# EAGLE design double layer relaycircuit (EAGLE 7.5.0)
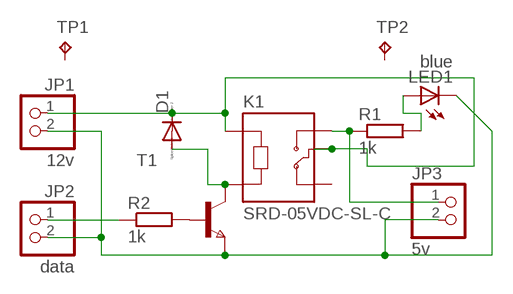
[diagram p0: schematic, sheet 1]

## Parts
D1  DIODE-SOD323-W  [SOD323-W]
JP1  12v  PINHD-1X2  [1X02]
JP2  data  PINHD-1X2  [1X02]
JP3  5v  PINHD-1X2  [1X02]
K1  SRD-05VDC-SL-C  [RELAY_SRD-05VDC-SL-C]
LED1  blue  LED5MM  [LED5MM]
R1  1k  R-EU_M0805  [M0805]
R2  1k  R-EU_M0805  [M0805]
T1  NPNSOT23  [SOT-23]
TP1  TPB1,27  [B1,27]
TP2  TPB1,27  [B1,27]

## Nets
N$1: JP3.1 K1.NO R1.1
N$2: R2.2 T1.3(B)
N$3: D1.A K1.A2 T1.1(C)
N$4: LED1.A R1.2
N$6: JP1.2 JP2.2 JP3.2 LED1.K(C) T1.2(E)
N$7: JP2.1 R2.1
N$8: D1.C JP1.1 K1.A1 K1.COM
Unconnected: K1.NC TP1.TP TP2.TP

## Library data of the parts
D1 = diode:DIODE-: DIODE
JP1-JP3 = pinhead:PINHD-1X2: PIN HEADER
K1 = SRD-05VDC-SL-C (1):SRD-05VDC-SL-C: 5V Trigger Relay Module For Arduino And Raspberry Pi 5V Trigger Relay Module For Arduino And Raspberry Pi Check availability <https://pricing.snapeda.com/parts/SRD-05VDC-SL-C/Songle%20Relay/view-part?ref=eda>; AVAILABILITY: Not in stock; DESCRIPTION: 5V Trigger Relay Module For Arduino And Raspberry Pi 5V Trigger Relay Module For Arduino And Raspberry Pi; MF: Songle Relay; MP: SRD-05VDC-SL-C; PACKAGE: None; PRICE: None
LED1 = led:LED: LED OSRAM: - CHIPLED LG R971, LG N971, LY N971, LG Q971, LY Q971, LO R971, LY R971 LH N974, LH R974 LS Q976, LO Q976, LY Q976 LO Q996 - Hyper CHIPLED LW Q18S LB Q993, LB Q99A, LB R99A - SideLED LS A670, LO A670, LY A670, LG A670, LP A670 LB A673, LV A673, LT A673, LW A673 LH A674 LY A675 LS A676, LA A676, LO A676, LY A676, LW A676 LS A679, LY A679, LG A679 - Hyper Micro SIDELED® LS Y876, LA Y876, LO Y876, LY Y876 LT Y87S - SmartLED LW L88C, LW L88S LB L89C, LB L89S, LG L890 LS L89K, LO L89K, LY L89K LS L896, LA L896, LO L896, LY L896 - TOPLED LS T670, LO T670, LY T670, LG T670, LP T670 LSG T670, LSP T670, LSY T670, LOP T670, LYG T670 LG T671, LOG T671, LSG T671 LB T673, LV T673, LT T673, LW T673 LH T674 LS T676, LA T676, LO T676, LY T676, LB T676, LH T676, LSB T676, LW T676 LB T67C, LV T67C, LT T67C, LS T67K, LO T67K, LY T67K, LW E67C LS E67B, LA E67B, LO E67B, LY E67B, LB E67C, LV E67C, LT E67C LW T67C LS T679, LY T679, LG T679 LS T770, LO T770, LY T770, LG T770, LP T770 LB T773, LV T773, LT T773, LW T773 LH T774 LS E675, LA E675, LY E675, LS T675 LS T776, LA T776, LO T776, LY T776, LB T776 LHGB T686 LT T68C, LB T68C - Hyper Mini TOPLED® LB M676 - Mini TOPLED Santana® LG M470 LS M47K, LO M47K, LY M47K Source: http://www.osram.convergy.de LUXEON: - LUMILED® LXK2-PW12-R00, LXK2-PW12-S00, LXK2-PW14-U00, LXK2-PW14-V00 LXK2-PM12-R00, LXK2-PM12-S00, LXK2-PM14-U00 LXK2-PE12-Q00, LXK2-PE12-R00, LXK2-PE12-S00, LXK2-PE14-T00, LXK2-PE14-U00 LXK2-PB12-K00, LXK2-PB12-L00, LXK2-PB12-M00, LXK2-PB14-N00, LXK2-PB14-P00, LXK2-PB14-Q00 LXK2-PR12-L00, LXK2-PR12-M00, LXK2-PR14-Q00, LXK2-PR14-R00 LXK2-PD12-Q00, LXK2-PD12-R00, LXK2-PD12-S00 LXK2-PH12-R00, LXK2-PH12-S00 LXK2-PL12-P00, LXK2-PL12-Q00, LXK2-PL12-R00 Source: www.luxeon.com KINGBRIGHT: KA-3528ASYC Source: www.kingbright.com
R1 R2 = rcl:R-EU_: RESISTOR, European symbol
T1 = zetex:NPNSOT23: NPN TRANSISTOR; MPN: DSS20201L-7; OC_FARNELL: 1710688; OC_NEWARK: 25R4555
TP1 TP2 = testpad:TP: Test pad

## Board
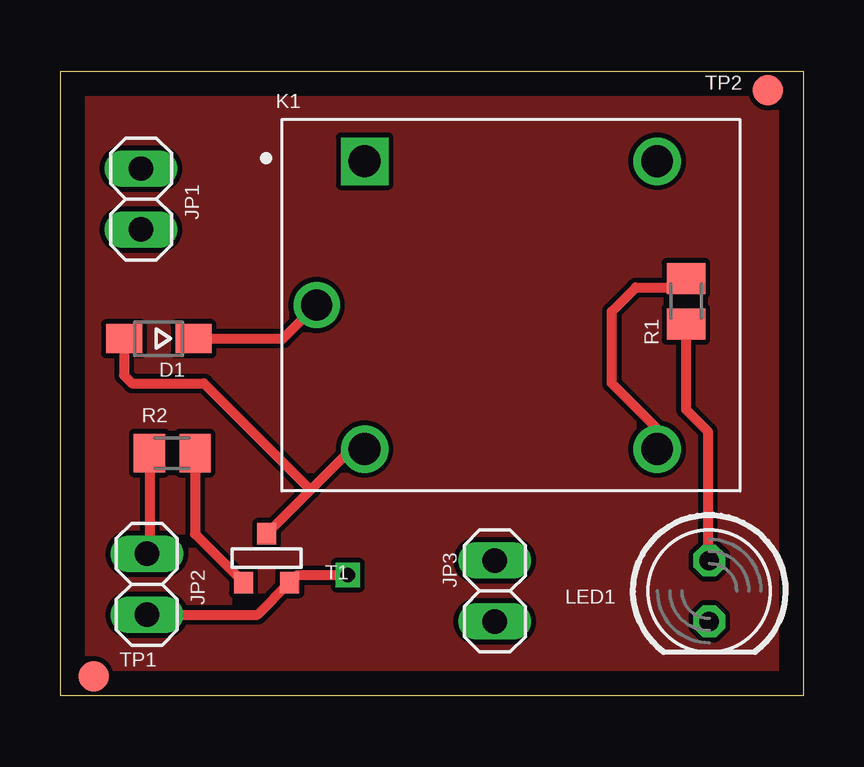
[diagram p1: board, top side]
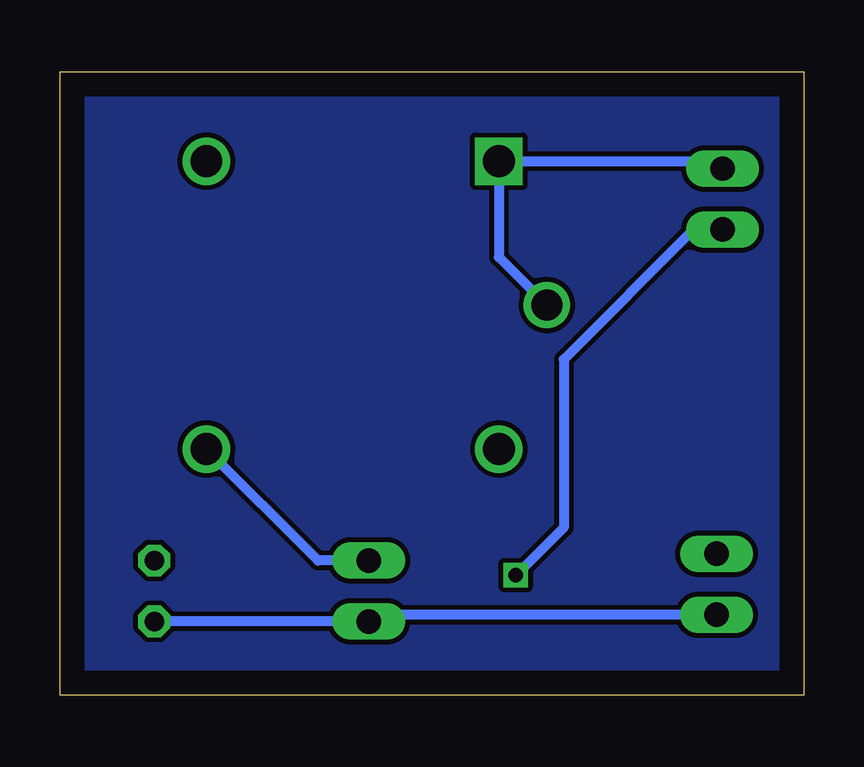
[diagram p2: board, bottom side, seen from below]

Size 31 x 26 mm. Coordinates in mm from the lower left corner, seen from the top.
Outline: 0,0 31,0 31,26 0,26 0,0
Copper layers (1*16): Top 0.035mm / dielectric 1.5mm / Bottom 0.035mm
Design rules "default": minimum track width 10mil, minimum drill 24mil, track to track 8mil, track to pad 8mil, pad to pad 8mil, via to via 8mil, smd to smd 8mil, copper to edge 40mil, drill to drill 8mil, minimum pad ring 10mil, minimum via ring 8mil, stop-mask expansion 4mil, vias tented up to drill 0mil, thermal gap 10mil

### Footprints (pad centres in the part's own frame; a part is rotated, then mirrored left to right if it is on the bottom)
SOD323-W = smd 1.5 x 1.2: A 1.45,0; C -1.45,0
1X02 = drill 1.016 long: 1 -1.27,0; 2 1.27,0
RELAY_SRD-05VDC-SL-C = drill 1.32 square: A1 -6.1,6 | drill 1.32: A2 -6.1,-6; NC 6.1,6; NO 6.1,-6 | drill 1.29: COM -8.1,0
LED5MM = drill 0.813 octagon: A -1.27,0; K 1.27,0
M0805 = smd 1.3 x 1.6: 1 -0.95,0; 2 0.95,0
SOT-23 = smd 0.787 x 0.889: 1 0.025,-1.016; 2 -0.94,1.016; 3 0.991,1.016
B1,27 = smd 1.27 x 1.27: TP 0,0

### Placement (x,y rotation side)
D1  4.12,14.86 180 top
JP1  3.38,20.68 270 top
JP2  3.62,4.62 270 top
JP3  18.13,4.34 270 top
K1  18.8,16.26 0 top
LED1  27.07,4.34 270 top
R1  26.1,16.42 270 top
R2  4.68,10.09 0 top
T1  8.64,5.71 180 top
TP1  1.4,0.79 180 top
TP2  29.52,25.21 0 top

### Tracks (layer width: path | path; a pad name or v marks a point on that pad's centre or on a via)
GND
  pour Bottom: 0,26 31,26 31,0 0,0
N$1
  Top 0.406: K1.NO 24.9,11.1 23,13 23,16 24,17 25.73,17 R1.1
  Bottom 0.406: JP3.1 20.25,5.61 K1.NO
N$2
  Top 0.406: R2.2 5.63,6.71 T1.3
N$3
  Top 0.406: K1.A2 12.15,10.26 10.44,8.56 | 10.44,8.56 T1.1 | D1.A 2.67,13.33 3,13 6,13 10.44,8.56
N$4
  Top 0.406: R1.2 26.1,11.9 27,11 27,5.68 LED1.A
N$5
  pour Top: 0,26 31,26 31,0 0,0
N$6  (via drill 0.6)
  Top 0.406: JP2.2 8.24,3.35 T1.2 9.89,5 v12,5
  Bottom 0.406: JP2.2 17.85,3.35 JP3.2 LED1.K | JP1.2 4.59,19.41 10,14 10,7 v12,5
N$7
  Top 0.406: R2.1 3.73,6 JP2.1
N$8
  Top 0.406: D1.C 9.3,14.86 K1.COM
  Bottom 0.406: JP1.1 4.69,22.26 K1.A1 12.7,18.26 K1.COM